# Altium schematic sheet Schematic_altium.schdoc
size 299 x 213 mm
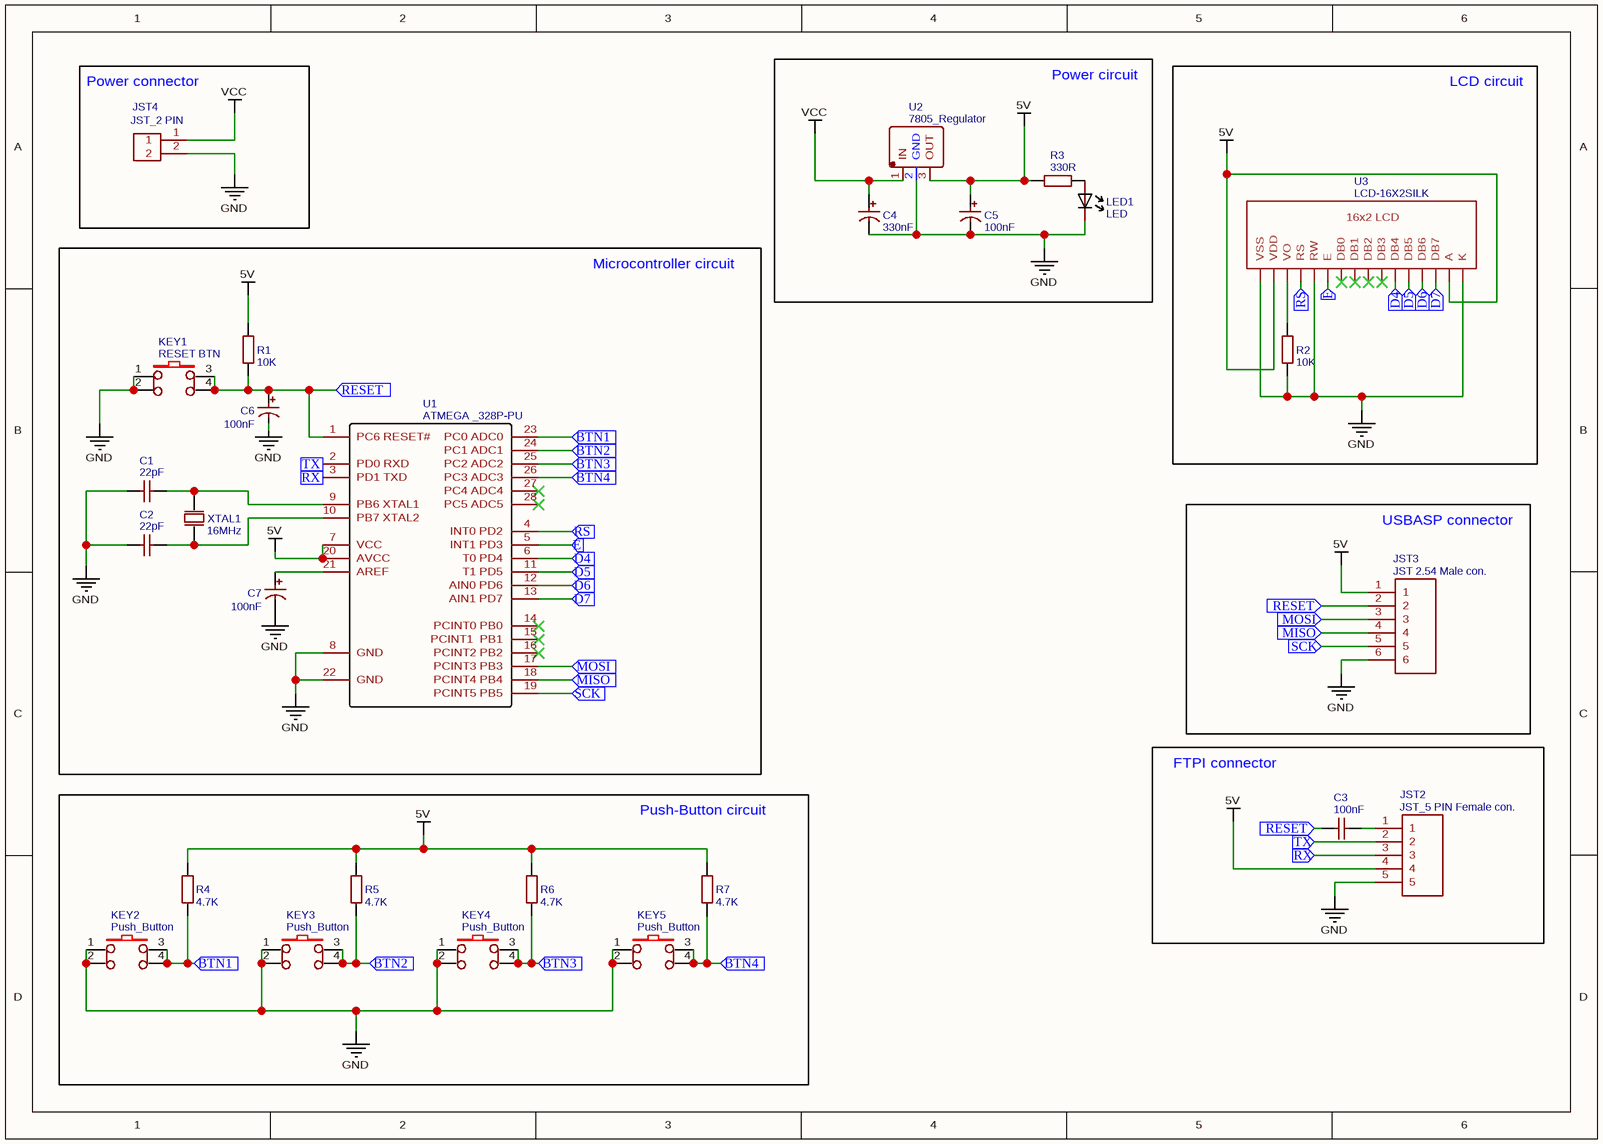
[diagram p0: Schematic_altium.schdoc]

## Parts
C1  22pF  [CAP-TH_L3.5-W3.0-P2.54-D0.8]
C2  22pF  [CAP-TH_L3.5-W3.0-P2.54-D0.8]
C3  100nF  [RAD-0.2]
C4  330nF  [CAP-TH_BD5.0-P2.00-D0.8-FD]
C5  100nF  [CAP-TH_BD5.0-P2.00-D0.8-FD]
C6  100nF  [CAP-TH_BD5.0-P2.00-D0.8-FD]
C7  100nF  [CAP-TH_BD5.0-P2.00-D0.8-FD]
JST2  JST_5 PIN Female con.  [JST 2.54MM MALE 5 PIN CONNECTOR]
JST3  JST 2.54 Male con.  [JST 2.54MM MALE 6 PIN CONNECTOR_N]
JST4  JST_2 PIN  [CONN-TH_XHB-2A]
KEY1  RESET BTN  [KEY-TH_4P-L6.0-W6.0-P4.50]
KEY2  Push_Button  [KEY-TH_4P-L6.0-W6.0-P4.50]
KEY3  Push_Button  [KEY-TH_4P-L6.0-W6.0-P4.50]
KEY4  Push_Button  [KEY-TH_4P-L6.0-W6.0-P4.50]
KEY5  Push_Button  [KEY-TH_4P-L6.0-W6.0-P4.50]
LED1  LED  [5MM LED]
R1  10K  [AXIAL-0.4]
R2  10K  [AXIAL-0.4]
R3  330R  [AXIAL-0.4]
R4  4.7K  [AXIAL-0.4]
R5  4.7K  [AXIAL-0.4]
R6  4.7K  [AXIAL-0.4]
R7  4.7K  [AXIAL-0.4]
U1  ATMEGA _328P-PU  [DIP-28_L34.6-W7.3-P2.54-LS10.2-BL]
U2  7805_Regulator  [TO-220-3_L10.0-W4.5-P2.54-L]
U3  LCD-16X2SILK  [LCD-16X2]
XTAL1  16MHz  [16MHZ_OSC [PCB]]

## Blocks framed on the sheet
Power connector: JST4
Power circuit: C4 C5 LED1 R3 U2
LCD circuit: R2 U3
Microcontroller circuit: C1 C2 C6 C7 KEY1 R1 U1 XTAL1
USBASP connector: JST3
FTPI connector: C3 JST2
Push-Button circuit: KEY2-KEY5 R4-R7

## Ports
BTN1 (in), BTN2 (in), BTN3 (in), BTN4 (in), D4 (in), D5 (in), D6 (in), D7 (in), E (in), MISO (in), MOSI (in), RESET (in), RS (in), RX (in), SCK (in), TX (in)

## Nets
5V: C5.1 JST2.4 JST3.1 R1.2 R3.1 R4.2 R5.2 R6.2 R7.2 U1.7(VCC) U1.20(AVCC) U2.3(OUT) U3.2(VDD) U3.15(A)
GND: C1.1 C2.1 C4.2 C5.2 C6.2 C7.2 JST2.5 JST3.6 JST4.2 KEY1.1 KEY1.2 KEY2.1 KEY2.2 KEY3.1 KEY3.2 KEY4.1 KEY4.2 KEY5.1 KEY5.2 LED1.2 R2.1 U1.8(GND) U1.22(GND) U2.2(GND) U3.1(VSS) U3.5(RW) U3.16(K)
VCC: C4.1 JST4.1 U2.1(IN)
BTN1: KEY2.3 KEY2.4 R4.1 U1.23(PC0_ADC0) ; port BTN1
BTN2: KEY3.3 KEY3.4 R5.1 U1.24(PC1_ADC1) ; port BTN2
BTN3: KEY4.3 KEY4.4 R6.1 U1.25(PC2_ADC2) ; port BTN3
BTN4: KEY5.3 KEY5.4 R7.1 U1.26(PC3_ADC3) ; port BTN4
D4: U1.6(T0_PD4) U3.11(DB4) ; port D4
D5: U1.11(T1_PD5) U3.12(DB5) ; port D5
D6: U1.12(AIN0_PD6) U3.13(DB6) ; port D6
D7: U1.13(AIN1_PD7) U3.14(DB7) ; port D7
E: U1.5(INT1_PD3) U3.6(E) ; port E
MISO: JST3.4 U1.18(PCINT4_PB4) ; port MISO
MOSI: JST3.3 U1.17(PCINT3_PB3) ; port MOSI
RESET: C3.1 C6.1 JST3.2 KEY1.3 KEY1.4 R1.1 U1.1(PC6_RESET#) ; port RESET
RS: U1.4(INT0_PD2) U3.4(RS) ; port RS
RX: JST2.3 U1.3(PD1_TXD) ; port RX
SCK: JST3.5 U1.19(PCINT5_PB5) ; port SCK
TX: JST2.2 U1.2(PD0_RXD) ; port TX
NetC1_2: C1.2 U1.9(PB6_XTAL1) XTAL1.1(OSC1)
NetC2_2: C2.2 U1.10(PB7_XTAL2) XTAL1.2(OSC2)
NetC3_2: C3.2 JST2.1
NetC7_1: C7.1 U1.21(AREF)
NetLED1_1: LED1.1 R3.2
NetR2_2: R2.2 U3.3(VO)

Not connected (* = marked no-connect by the designer): U1 14(PCINT0_PB0)* 15(PCINT1__PB1)* 16(PCINT2_PB2)* 27(PC4_ADC4)* 28(PC5_ADC5)*; U3 7(DB0)* 8(DB1)* 9(DB2)* 10(DB3)*

## Notes on the sheet
- (in symbol LCD-16X2SILK) 16x2 LCD

## Library data of the parts
C1 C2 = 22pF: BOM_Manufacturer: ReliaPro; BOM_Manufacturer Part: 22pf/50V 10%; nameAlias: Capacitance; BOM_Supplier: LCSC; BOM_Supplier Part: C9316; spicePre: C; spiceSymbolName: 22pF
C3 = 100nF: BOM_Manufacturer: LCSC; BOM_Manufacturer Part: 0.1UF(104) +-20% 63v; Value: 100nF; BOM_Supplier: LCSC; BOM_Supplier Part: C19355; spicePre: C; spiceSymbolName: 100nF
C4 = 330nF: BOM_Manufacturer: ValuePro; BOM_Manufacturer Part: 0.33uF 50V 5*11; nameAlias: Capacitance; BOM_Supplier: LCSC; BOM_Supplier Part: C45097; BOM_JLCPCB Part Class: Extended Part; spicePre: C; spiceSymbolName: 0.33uF
C5-C7 = 100nF: BOM_Manufacturer: ValuePro; BOM_Manufacturer Part: 0.1UF 50V; nameAlias: Capacitance; BOM_Supplier: LCSC; BOM_Supplier Part: C28061; BOM_JLCPCB Part Class: Extended Part; spicePre: C; spiceSymbolName: 0.1uF
JST2 = JST_5 PIN Female con.: Contributor: MagnusInc; spicePre: U; spiceSymbolName: JST_5 PIN
JST3 = JST 2.54 Male con.: Contributor: MagnusInc; spicePre: U; spiceSymbolName: JST_6  PIN
JST4 = JST_2 PIN: BOM_Manufacturer: BOOMELE; BOM_Manufacturer Part: XHB-2A Connector; BOM_Supplier: LCSC; image: //image.lceda.cn/szlcsc/C57981.jpg; BOM_Supplier Part: C57981; BOM_JLCPCB Part Class: Extended Part; spicePre: C; spiceSymbolName: JST_2 PIN
KEY1 = RESET BTN: BOM_Manufacturer: ReliaPro; BOM_Manufacturer Part: button6*6*8.5; BOM_Supplier Part: C59980; BOM_Supplier: LCSC; image: http://image.lceda.cn/szlcsc/C59980.jpg; spicePre: K; spiceSymbolName: Push_Button
KEY2-KEY5 = Push_Button: BOM_Manufacturer: ReliaPro; BOM_Manufacturer Part: button6*6*8.5; BOM_Supplier Part: C59980; BOM_Supplier: LCSC; image: http://image.lceda.cn/szlcsc/C59980.jpg; spicePre: K; spiceSymbolName: Push_Button
LED1 = LED: Contributor: Axbri; BOM_Manufacturer Part: 5mm LED; spicePre: U; spiceSymbolName: LED
R1 R2 = 10K: BOM_Manufacturer: UniOhm; BOM_Manufacturer Part: MFR0W4F2200A50; Power: 1/4W; Tolerance: ±1%; BOM_EasyEDA: E57439; Value: Value; BOM_Supplier Part: E57439; BOM_Supplier: EasyEDA; spicePre: R; spiceSymbolName: RESISTOR
R3 = 330R: BOM_Manufacturer: UniOhm; BOM_Manufacturer Part: MFR0W4F2200A50; Power: 1/4W; Tolerance: ±1%; BOM_EasyEDA: E57439; Value: Value; BOM_Supplier Part: E57439; BOM_Supplier: EasyEDA; spicePre: R; spiceSymbolName: RESISTOR
R4-R7 = 4.7K: BOM_Manufacturer: UniOhm; BOM_Manufacturer Part: MFR0W4F2200A50; Power: 1/4W; Tolerance: ±1%; BOM_EasyEDA: E57439; Value: Value; BOM_Supplier Part: E57439; BOM_Supplier: EasyEDA; spicePre: R; spiceSymbolName: RESISTOR
U1 = ATMEGA _328P-PU: BOM_Manufacturer: MICROCHIP; BOM_Manufacturer Part: ATMEGA328P-PU; sourceId: Oic6oiASL; Contributor: LCSC; timeStamp: 1451725987; BOM_Supplier: LCSC; image: //image.lceda.cn/szlcsc/C33901.jpg; BOM_Supplier Part: C33901; spicePre: U; spiceSymbolName: ATMEGA _328P-PU
U2 = 7805_Regulator: BOM_Manufacturer: Foshan Blue Rocket Elec; BOM_Manufacturer Part: 7805; Contributor: LCSC; BOM_Supplier: LCSC; BOM_Supplier Part: C305416; BOM_JLCPCB Part Class: Extended Part; spicePre: U; spiceSymbolName: 7805_Regulator
U3 = LCD-16X2SILK: description: Standard text-only 16x2 parallel input LCD; Contributor: SparkFun; spicePre: U; spiceSymbolName: LCD-16X2SILK
XTAL1 = 16MHz: BOM_Manufacturer: SHIVRAM; BOM_Manufacturer Part: 0SC-16MHz; nameAlias: Frequency; Contributor: Mantas Petrauskas; BOM_Supplier: SHIVRAM; BOM_Supplier Part: 0SC-16MHz; spicePre: X; spiceSymbolName: Crystal Oscillator